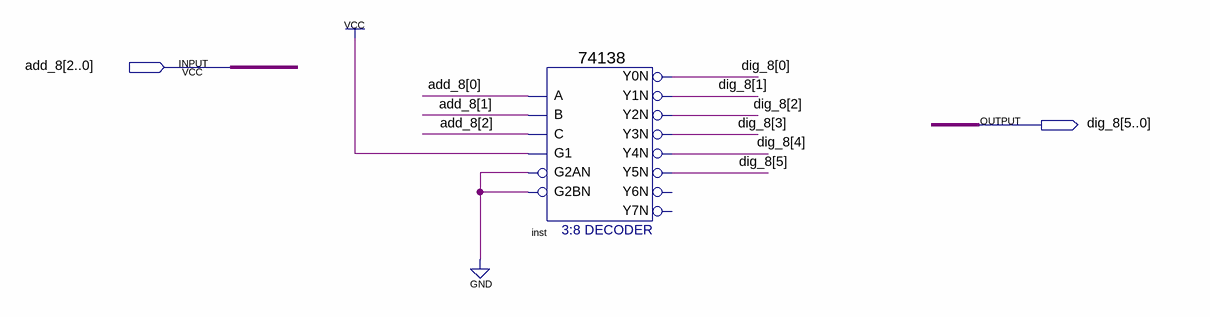
[diagram p0: schematic sheet]
// Quartus schematic dig_select_8.bdf as structural Verilog: 1 symbols, 2 pins
module dig_select_8 (
  input  [2:0] add_8,
  output [5:0] dig_8
);

  \74138  inst (
    .A(add_8[0]), .B(add_8[1]), .G1(1'b1), .C(add_8[2]), .G2AN(1'b0), .G2BN(1'b0), .Y0N(dig_8[0]),
    .Y1N(dig_8[1]), .Y2N(dig_8[2]), .Y3N(dig_8[3]), .Y4N(dig_8[4]), .Y5N(dig_8[5]));  // open: Y6N, Y7N
endmodule
